# Altium project Ultrasound Smart Probe_Ver2.PrjPcb (part 3 of 9)

## Sheet Input Output Connector.SchDoc: Input Output Connectors
size 431 x 279 mm; Date: Not shown in title block; ApprovedBy: Not shown in title block; CheckedBy: Not shown in title block; Author: Not shown in title block; CompanyName: Not shown in title block; DrawnBy: Abhishek Vishwa; Engineer: Not shown in title block; Organization: Not shown in title block; Address1: Not shown in title block; Address2: Not shown in title block; Address3: Not shown in title block; Address4: Not shown in title block; DocumentNumber: 1; Revision: Use project parameter SCH_Rev; SheetNumber: 5; SheetTotal: 12; PageSetup: Record=PageOptions|CenterHorizontal=True|CenterVertical=True|PrintScale=1.00|XCorrection=1.00|YCorrection=1.00|PrintKind=0|BorderSize=5000000|LeftOffset=0|BottomOffset=0|Orientation=2|PaperLength=1000|PaperWidth=1000|Scale=100|PaperSource=15|PrintQuality=600|MediaType=1|DitherType=10|PaperKind=Letter|PrintScaleMode=1; CurrentTime: Not shown in title block; CurrentDate: Not shown in title block; Time: Not shown in title block; DocumentFullPathAndName: Not shown in title block; DocumentName: Not shown in title block; ModifiedDate: Not shown in title block; ImagePath: Not shown in title block
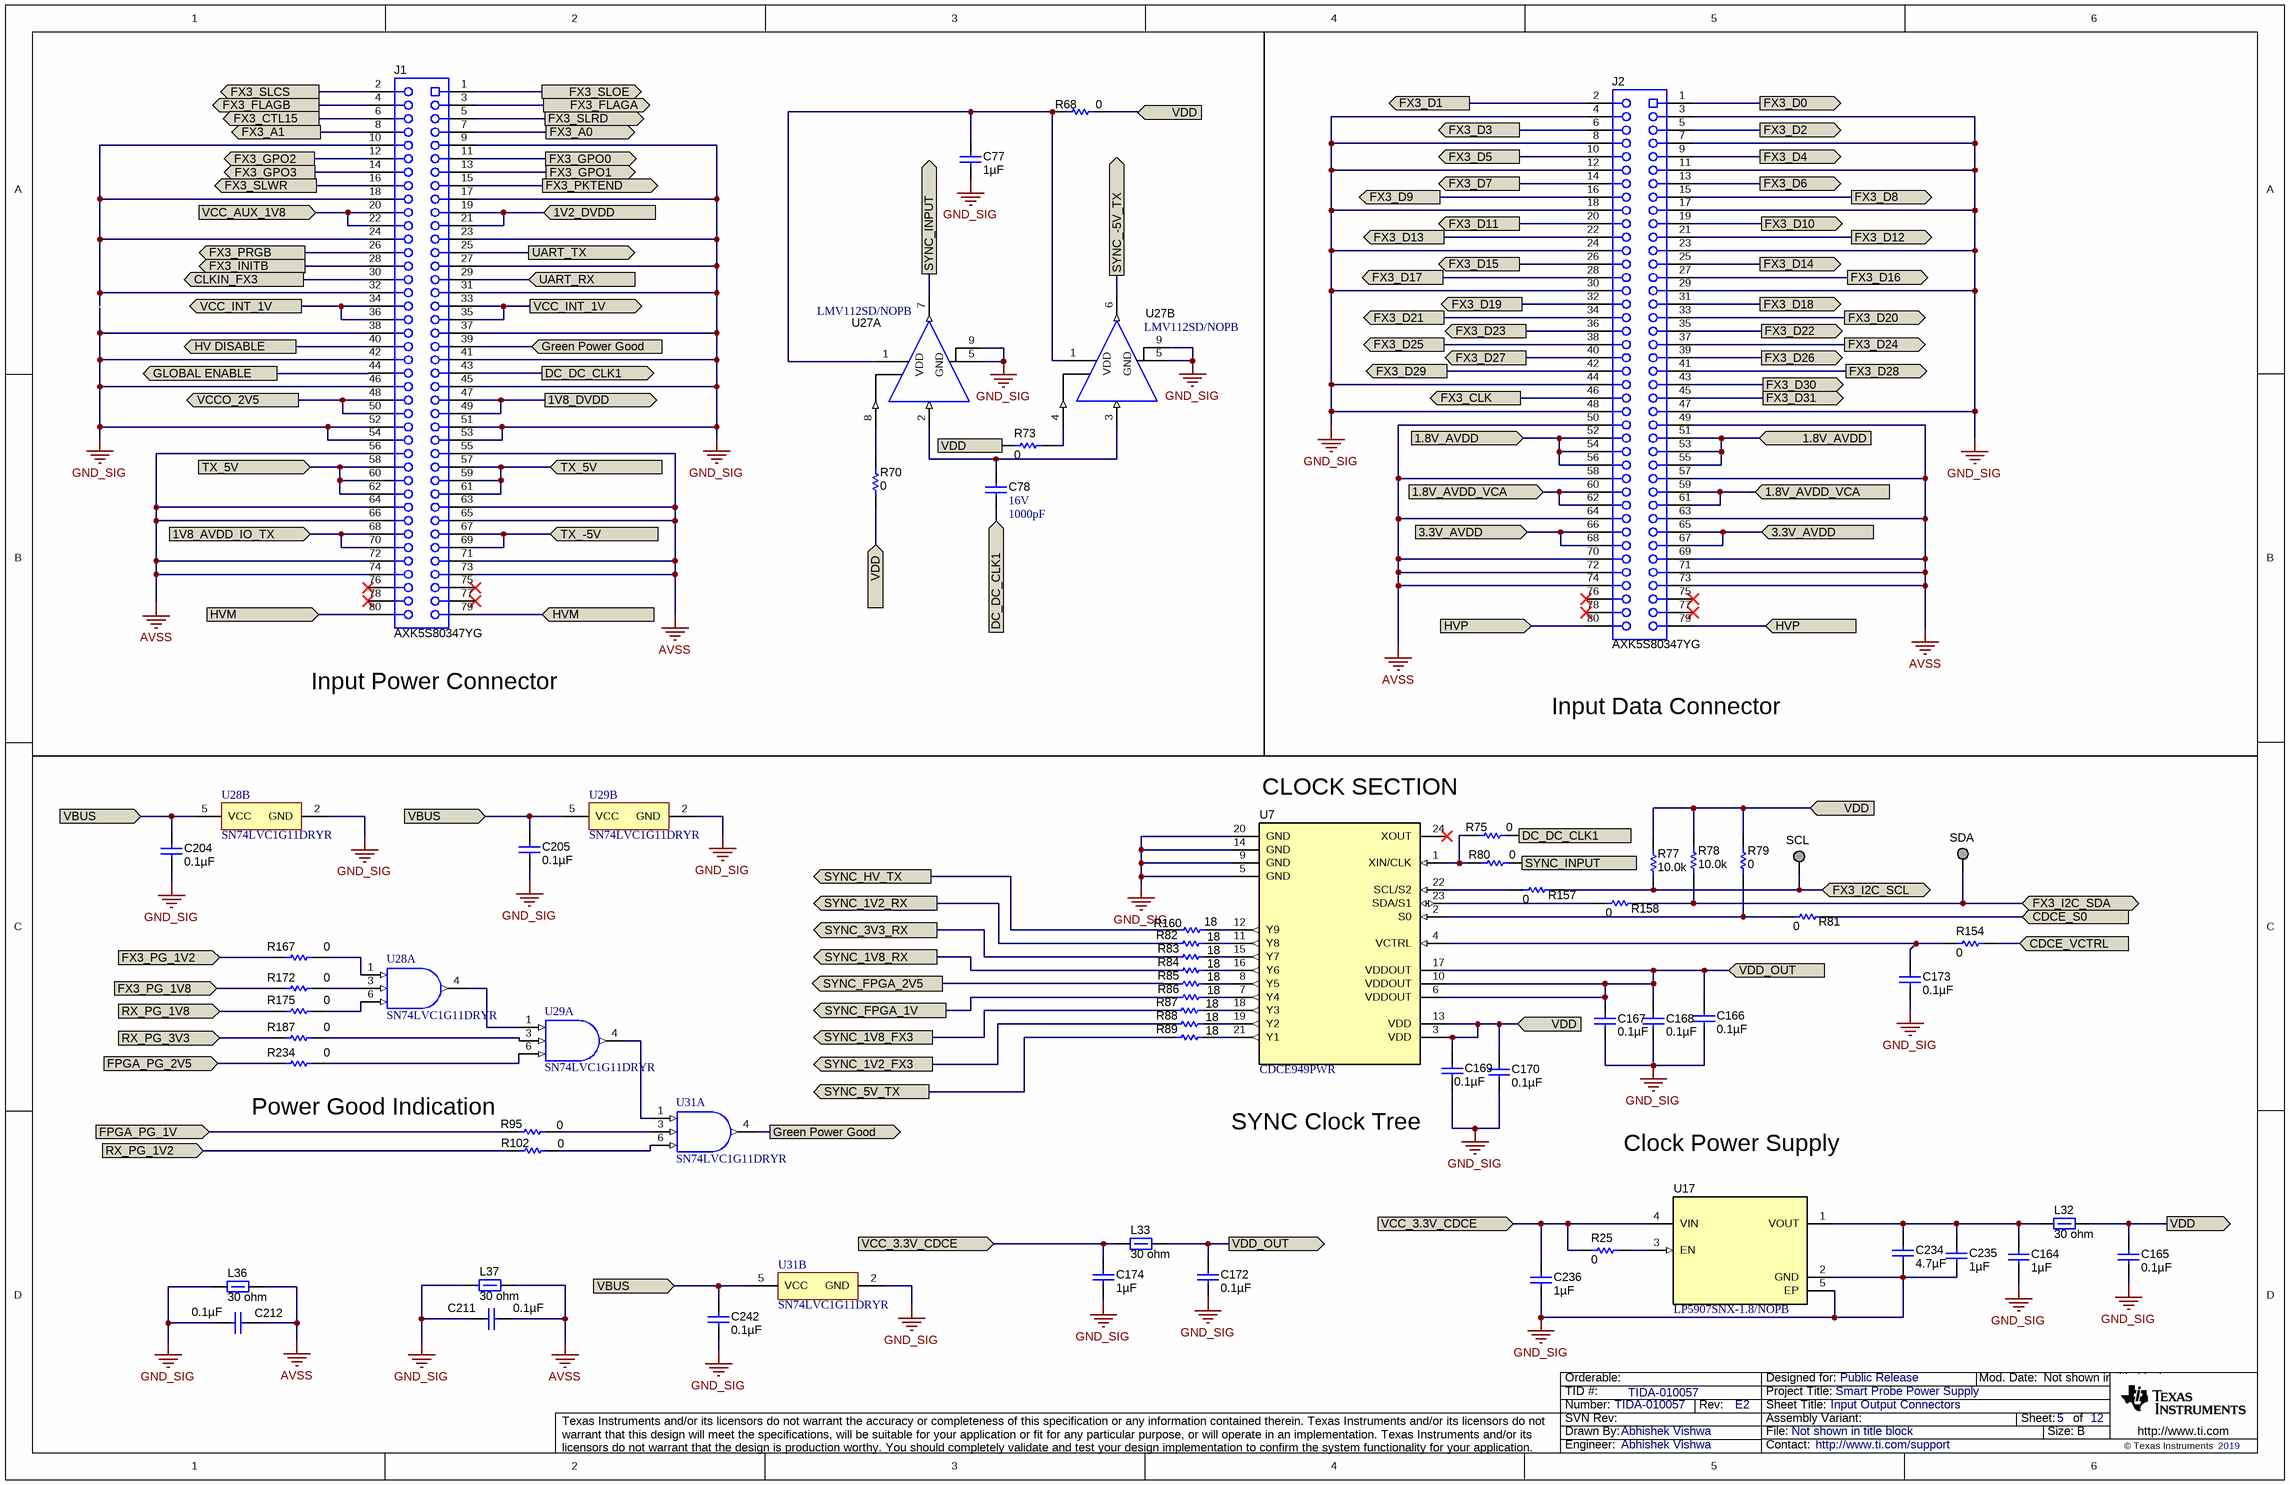
[diagram p2: Input Output Connector.SchDoc]

### Parts
C77  ValueDisplayed: 1µF  [0402]  (hidden comment: C1005X6S1C105K050BC)
C78  VDC_V: 16V  ValueDisplayed: 1000pF  [0201]  (hidden comment: GRM033R71C102KA01D)
C164  ValueDisplayed: 1µF  [0402]  (hidden comment: C1005X6S1C105K050BC)
C165  ValueDisplayed: 0.1µF  [0402]  (hidden comment: GRM155R61E104KA87D)
C166  ValueDisplayed: 0.1µF  [0402]  (hidden comment: GRM155R61E104KA87D)
C167  ValueDisplayed: 0.1µF  [0402]  (hidden comment: GRM155R61E104KA87D)
C168  ValueDisplayed: 0.1µF  [0402]  (hidden comment: GRM155R61E104KA87D)
C169  ValueDisplayed: 0.1µF  [0402]  (hidden comment: GRM155R61E104KA87D)
C170  ValueDisplayed: 0.1µF  [0402]  (hidden comment: GRM155R61E104KA87D)
C172  ValueDisplayed: 0.1µF  [0402]  (hidden comment: GRM155R61E104KA87D)
C173  ValueDisplayed: 0.1µF  [0402]  (hidden comment: GRM155R61E104KA87D)
C174  ValueDisplayed: 1µF  [0402]  (hidden comment: C1005X6S1C105K050BC)
C204  ValueDisplayed: 0.1µF  [0402]  (hidden comment: GRM155R61E104KA87D)
C205  ValueDisplayed: 0.1µF  [0402]  (hidden comment: GRM155R61E104KA87D)
C211  ValueDisplayed: 0.1µF  [0402]  (hidden comment: GRM155R61E104KA87D)
C212  ValueDisplayed: 0.1µF  [0402]  (hidden comment: GRM155R61E104KA87D)
C234  ValueDisplayed: 4.7µF  [0603]  (hidden comment: GRM188R61A475MAAJ)
C235  ValueDisplayed: 1µF  [0603]  (hidden comment: 885012206052)
C236  ValueDisplayed: 1µF  [0603]  (hidden comment: 885012206052)
C242  ValueDisplayed: 0.1µF  [0402]  (hidden comment: GRM155R61E104KA87D)
J1  AXK5S80347YG  [Panasonic_AXK5S80347Y]
J2  AXK5S80347YG  [Panasonic_AXK5S80347Y]
L32  ValueDisplayed: 30 ohm  [0603]  (hidden comment: 742792609)
L33  ValueDisplayed: 30 ohm  [0603]  (hidden comment: 742792609)
L36  ValueDisplayed: 30 ohm  [0603]  (hidden comment: 742792609)
L37  ValueDisplayed: 30 ohm  [0603]  (hidden comment: 742792609)
R25  ValueDisplayed: 0  [0402]  (hidden comment: ERJ-2GE0R00X)
R68  ValueDisplayed: 0  [0402]  (hidden comment: ERJ-2GE0R00X)
R70  ValueDisplayed: 0  [0402]  (hidden comment: ERJ-2GE0R00X)
R73  ValueDisplayed: 0  [0402]  (hidden comment: ERJ-2GE0R00X)
R75  ValueDisplayed: 0  [0402]  (hidden comment: ERJ-2GE0R00X)
R77  ValueDisplayed: 10.0k  [0402]  (hidden comment: ERJ-2RKF1002X)
R78  ValueDisplayed: 10.0k  [0402]  (hidden comment: ERJ-2RKF1002X)
R79  ValueDisplayed: 0  [0402]  (hidden comment: ERJ-2GE0R00X)
R80  ValueDisplayed: 0  [0402]  (hidden comment: ERJ-2GE0R00X)
R81  ValueDisplayed: 0  [0402]  (hidden comment: ERJ-2GE0R00X)
R82  ValueDisplayed: 18  [0402]  (hidden comment: CRCW040218R0JNED)
R83  ValueDisplayed: 18  [0402]  (hidden comment: CRCW040218R0JNED)
R84  ValueDisplayed: 18  [0402]  (hidden comment: CRCW040218R0JNED)
R85  ValueDisplayed: 18  [0402]  (hidden comment: CRCW040218R0JNED)
R86  ValueDisplayed: 18  [0402]  (hidden comment: CRCW040218R0JNED)
R87  ValueDisplayed: 18  [0402]  (hidden comment: CRCW040218R0JNED)
R88  ValueDisplayed: 18  [0402]  (hidden comment: CRCW040218R0JNED)
R89  ValueDisplayed: 18  [0402]  (hidden comment: CRCW040218R0JNED)
R95  ValueDisplayed: 0  [0201]  (hidden comment: ERJ-1GE0R00C)
R102  ValueDisplayed: 0  [0201]  (hidden comment: ERJ-1GE0R00C)
R154  ValueDisplayed: 0  [0402]  (hidden comment: ERJ-2GE0R00X)
R157  ValueDisplayed: 0  [0402]  (hidden comment: ERJ-2GE0R00X)
R158  ValueDisplayed: 0  [0402]  (hidden comment: ERJ-2GE0R00X)
R160  ValueDisplayed: 18  [0402]  (hidden comment: CRCW040218R0JNED)
R167  ValueDisplayed: 0  [0201]  (hidden comment: ERJ-1GE0R00C)
R172  ValueDisplayed: 0  [0201]  (hidden comment: ERJ-1GE0R00C)
R175  ValueDisplayed: 0  [0201]  (hidden comment: ERJ-1GE0R00C)
R187  ValueDisplayed: 0  [0201]  (hidden comment: ERJ-1GE0R00C)
R234  ValueDisplayed: 0  [0201]  (hidden comment: ERJ-1GE0R00C)
SCL  TESTPOINT  [TP_H045P075]  (value not drawn)  (no BOM)
SDA  TESTPOINT  [TP_H045P075]  (value not drawn)  (no BOM)
U7  CDCE949PWR  [PW0024A_N]
U17  LP5907SNX-1.8/NOPB  [DQN0004A]
U27  LMV112SD/NOPB  [NGQ0008A]  (parts A,B of 2)
U28  SN74LVC1G11DRYR  [DRY0006A]  (parts A,B of 2)
U29  SN74LVC1G11DRYR  [DRY0006A]  (parts A,B of 2)
U31  SN74LVC1G11DRYR  [DRY0006A]  (parts A,B of 2)

### Ports
1.8V_AVDD (in), 1.8V_AVDD_VCA (in), 1V2_DVDD (in), 1V8_AVDD_IO_TX (in), 1V8_DVDD (out), 3.3V_AVDD (in), CDCE_S0 (in), CDCE_VCTRL (in), CLKIN_FX3 (out), DC_DC_CLK1 (in), DC_DC_CLK1 (out), FPGA_PG_1V (in), FPGA_PG_2V5 (in), FX3_A0 (out), FX3_A1 (out), FX3_CLK (out), FX3_CTL15 (out), FX3_D0 (out), FX3_D1 (out), FX3_D2 (out), FX3_D3 (out), FX3_D4 (out), FX3_D5 (out), FX3_D6 (out), FX3_D7 (out), FX3_D8 (out), FX3_D9 (out), FX3_D10 (out), FX3_D11 (out), FX3_D12 (out), FX3_D13 (out), FX3_D14 (out), FX3_D15 (out), FX3_D16 (out), FX3_D17 (out), FX3_D18 (out), FX3_D19 (out), FX3_D20 (out), FX3_D21 (out), FX3_D22 (out), FX3_D23 (out), FX3_D24 (out), FX3_D25 (out), FX3_D26 (out), FX3_D27 (out), FX3_D28 (out), FX3_D29 (out), FX3_D30 (out), FX3_D31 (out), FX3_FLAGA (out), FX3_FLAGB (out), FX3_GPO0 (out), FX3_GPO1 (out), FX3_GPO2 (out), FX3_GPO3 (out), FX3_I2C_SCL (bidir), FX3_I2C_SDA (bidir), FX3_INITB (out), FX3_PG_1V2 (in), FX3_PG_1V8 (in), FX3_PKTEND (out), FX3_PRGB (out), FX3_SLCS (out), FX3_SLOE (out), FX3_SLRD (out), FX3_SLWR (out), GLOBAL ENABLE (out), Green Power Good (in), Green Power Good (out), HV DISABLE (out), HVM (in), HVP (in), RX_PG_1V2 (in), RX_PG_1V8 (in), RX_PG_3V3 (in), SYNC_1V2_FX3 (out), SYNC_1V2_RX (out), SYNC_1V8_FX3 (out), SYNC_1V8_RX (out), SYNC_3V3_RX (out), SYNC_5V_TX (out), SYNC_-5V_TX (out), SYNC_FPGA_1V (out), SYNC_FPGA_2V5 (out), SYNC_HV_TX (out), SYNC_INPUT (in), SYNC_INPUT (out), TX_5V (in), TX_-5V (in), UART_RX (in), UART_TX (out), VBUS (in), VCC_3.3V_CDCE (in), VCC_AUX_1V8 (in), VCC_INT_1V (out), VCCO_2V5 (out), VDD (in), VDD (out), VDD_OUT (in), VDD_OUT (out)

### Nets
AVSS: C211.1 C212.1 J1.55 J1.56 J1.63 J1.64 J1.65 J1.66 J1.71 J1.72 J1.73 J1.74 J2.49 J2.50 J2.57 J2.58 J2.63 J2.64 J2.69 J2.70 J2.71 J2.72 J2.73 J2.74 L36.2 L37.2
GND_SIG: C77.2 C164.2 C165.2 C166.2 C167.2 C168.2 C169.2 C170.2 C172.2 C173.2 C174.2 C204.2 C205.2 C211.2 C212.2 C234.2 C235.2 C236.2 C242.2 J1.9 J1.17 J1.23 J1.27 J1.31 J1.37 J1.38 J1.41 J1.42 J1.45 J1.46 J1.51 J1.52 J1.53 J1.54 J2.3 J2.4 J2.7 J2.8 J2.11 J2.12 J2.17 J2.18 J2.23 J2.24 J2.29 J2.30 J2.44 J2.47 J2.48 L36.1 L37.1 U7.5(GND) U7.9(GND) U7.14(GND) U7.20(GND) U17.2(GND) U17.5(EP) U27.5(GND) U27.9(PAD) U28.2(GND) U29.2(GND) U31.2(GND)
1.8V_AVDD: J2.51 J2.52 J2.53 J2.54 J2.55 J2.56 ; port 1.8V_AVDD
1.8V_AVDD_VCA: J2.59 J2.60 J2.61 J2.62 ; port 1.8V_AVDD_VCA
1V2_DVDD: J1.19 J1.21 ; port 1V2_DVDD
1V8_AVDD_IO_TX: J1.68 J1.70 ; port 1V8_AVDD_IO_TX
1V8_DVDD: J1.47 J1.49 ; port 1V8_DVDD
3.3V_AVDD: J2.65 J2.66 J2.67 J2.68 ; port 3.3V_AVDD
CDCE_S0: R81.1 ; port CDCE_S0
CDCE_VCTRL: R154.1 ; port CDCE_VCTRL
CLKIN_FX3: J1.30 ; port CLKIN_FX3
DC_DC_CLK1: C78.2 J1.43 R75.2 ; port DC_DC_CLK1
FPGA_PG_1V: R95.1 ; port FPGA_PG_1V
FPGA_PG_2V5: R234.1 ; port FPGA_PG_2V5
FX3_A0: J1.7 ; port FX3_A0
FX3_A1: J1.8 ; port FX3_A1
FX3_CLK: J2.46 ; port FX3_CLK
FX3_CTL15: J1.6 ; port FX3_CTL15
FX3_D0: J2.1 ; port FX3_D0
FX3_D1: J2.2 ; port FX3_D1
FX3_D2: J2.5 ; port FX3_D2
FX3_D3: J2.6 ; port FX3_D3
FX3_D4: J2.9 ; port FX3_D4
FX3_D5: J2.10 ; port FX3_D5
FX3_D6: J2.13 ; port FX3_D6
FX3_D7: J2.14 ; port FX3_D7
FX3_D8: J2.15 ; port FX3_D8
FX3_D9: J2.16 ; port FX3_D9
FX3_D10: J2.19 ; port FX3_D10
FX3_D11: J2.20 ; port FX3_D11
FX3_D12: J2.21 ; port FX3_D12
FX3_D13: J2.22 ; port FX3_D13
FX3_D14: J2.25 ; port FX3_D14
FX3_D15: J2.26 ; port FX3_D15
FX3_D16: J2.27 ; port FX3_D16
FX3_D17: J2.28 ; port FX3_D17
FX3_D18: J2.31 ; port FX3_D18
FX3_D19: J2.32 ; port FX3_D19
FX3_D20: J2.33 ; port FX3_D20
FX3_D21: J2.34 ; port FX3_D21
FX3_D22: J2.35 ; port FX3_D22
FX3_D23: J2.36 ; port FX3_D23
FX3_D24: J2.37 ; port FX3_D24
FX3_D25: J2.38 ; port FX3_D25
FX3_D26: J2.39 ; port FX3_D26
FX3_D27: J2.40 ; port FX3_D27
FX3_D28: J2.41 ; port FX3_D28
FX3_D29: J2.42 ; port FX3_D29
FX3_D30: J2.43 ; port FX3_D30
FX3_D31: J2.45 ; port FX3_D31
FX3_FLAGA: J1.3 ; port FX3_FLAGA
FX3_FLAGB: J1.4 ; port FX3_FLAGB
FX3_GPO0: J1.11 ; port FX3_GPO0
FX3_GPO1: J1.13 ; port FX3_GPO1
FX3_GPO2: J1.12 ; port FX3_GPO2
FX3_GPO3: J1.14 ; port FX3_GPO3
FX3_I2C_SCL: R77.1 R157.1 SCL.1 ; port FX3_I2C_SCL
FX3_I2C_SDA: R78.1 R158.1 SDA.1 ; port FX3_I2C_SDA
FX3_INITB: J1.28 ; port FX3_INITB
FX3_PG_1V2: R167.1 ; port FX3_PG_1V2
FX3_PG_1V8: R172.1 ; port FX3_PG_1V8
FX3_PKTEND: J1.15 ; port FX3_PKTEND
FX3_PRGB: J1.26 ; port FX3_PRGB
FX3_SLCS: J1.2 ; port FX3_SLCS
FX3_SLOE: J1.1 ; port FX3_SLOE
FX3_SLRD: J1.5 ; port FX3_SLRD
FX3_SLWR: J1.16 ; port FX3_SLWR
GLOBAL ENABLE: J1.44 ; port GLOBAL ENABLE
Green Power Good: J1.39 U31.4(Y) ; port Green Power Good
HV DISABLE: J1.40 ; port HV DISABLE
HVM: J1.79 J1.80 ; port HVM
HVP: J2.79 J2.80 ; port HVP
RX_PG_1V2: R102.1 ; port RX_PG_1V2
RX_PG_1V8: R175.1 ; port RX_PG_1V8
RX_PG_3V3: R187.1 ; port RX_PG_3V3
SYNC_1V2_FX3: R88.1 ; port SYNC_1V2_FX3
SYNC_1V2_RX: R82.1 ; port SYNC_1V2_RX
SYNC_1V8_FX3: R87.1 ; port SYNC_1V8_FX3
SYNC_1V8_RX: R84.1 ; port SYNC_1V8_RX
SYNC_3V3_RX: R83.1 ; port SYNC_3V3_RX
SYNC_5V_TX: R89.1 ; port SYNC_5V_TX
SYNC_-5V_TX: U27.6(OUT2) ; port SYNC_-5V_TX
SYNC_FPGA_1V: R86.1 ; port SYNC_FPGA_1V
SYNC_FPGA_2V5: R85.1 ; port SYNC_FPGA_2V5
SYNC_HV_TX: R160.1 ; port SYNC_HV_TX
SYNC_INPUT: R80.2 U27.7(OUT1) ; port SYNC_INPUT
TX_5V: J1.57 J1.58 J1.59 J1.60 J1.61 J1.62 ; port TX_5V
TX_-5V: J1.67 J1.69 ; port TX_-5V
UART_RX: J1.29 ; port UART_RX
UART_TX: J1.25 ; port UART_TX
VBUS: C204.1 C205.1 C242.1 U28.5(VCC) U29.5(VCC) U31.5(VCC) ; port VBUS
VCC_3.3V_CDCE: C174.1 C236.1 L33.1 R25.2 U17.4(VIN) ; port VCC_3.3V_CDCE
VCC_AUX_1V8: J1.20 J1.22 ; port VCC_AUX_1V8
VCC_INT_1V: J1.33 J1.34 J1.35 J1.36 ; port VCC_INT_1V
VCCO_2V5: J1.48 J1.50 ; port VCCO_2V5
VDD: C165.1 C169.1 C170.1 L32.2 R68.1 R70.2 R73.1 R77.2 R78.2 R79.2 U7.3(VDD) U7.13(VDD) ; port VDD
VDD_OUT: C166.1 C167.1 C168.1 C172.1 L33.2 U7.6(VDDOUT) U7.10(VDDOUT) U7.17(VDDOUT) ; port VDD_OUT
NetC77_1: C77.1 R68.2 U27.1(VDD)
NetC78_1: C78.1 U27.2(IN1) U27.3(IN2)
NetC164_1: C164.1 C234.1 C235.1 L32.1 U17.1(VOUT)
NetC173_1: C173.1 R154.2 U7.4(VCTRL)
NetJ1_10: J1.10 J1.18 J1.24 J1.32
NetR25_1: R25.1 U17.3(EN)
NetR70_1: R70.1 U27.8(EN1)
NetR73_2: R73.2 U27.4(EN2)
NetR75_1: R75.1 R80.1 U7.1(XIN/CLK)
NetR79_1: R79.1 R81.2 U7.2(S0)
NetR82_2: R82.2 U7.11(Y8)
NetR83_2: R83.2 U7.15(Y7)
NetR84_2: R84.2 U7.16(Y6)
NetR85_2: R85.2 U7.8(Y5)
NetR86_2: R86.2 U7.7(Y4)
NetR87_2: R87.2 U7.18(Y3)
NetR88_2: R88.2 U7.19(Y2)
NetR89_2: R89.2 U7.21(Y1)
NetR95_2: R95.2 U31.3(B)
NetR102_2: R102.2 U31.6(C)
NetR157_2: R157.2 U7.22(SCL/S2)
NetR158_2: R158.2 U7.23(SDA/S1)
NetR160_2: R160.2 U7.12(Y9)
NetR167_2: R167.2 U28.1(A)
NetR172_2: R172.2 U28.3(B)
NetR175_2: R175.2 U28.6(C)
NetR187_2: R187.2 U29.3(B)
NetR234_2: R234.2 U29.6(C)
NetU28_4: U28.4(Y) U29.1(A)
NetU29_4: U29.4(Y) U31.1(A)

Not connected (* = marked no-connect by the designer): J1 75* 76* 77* 78*; J2 75* 76* 77* 78*; U7 24(XOUT)*

### Notes on the sheet
- Input Power Connector
- Input Data Connector
- CLOCK SECTION
- Power Good Indication
- SYNC Clock Tree
- Clock Power Supply
- Drawn By:
- SVN Rev:
- Number:
- TID #:
- Orderable:
- Rev:
- Sheet Title:
- File:
- Project Title:
- Designed for:
- Assembly Variant:
- Mod. Date:
- Sheet:
- Size:
- of
- B
- http://www.ti.com
- Texas Instruments and/or its licensors do not warrant the accuracy or completeness of this specification or any information contained therein. Texas Instruments and/or its licensors do not warrant that this design will meet the specifications, will be suitable for your application or fit for any particular purpose, or will operate in an implementation. Texas Instruments and/or its licensors do not warrant that the design is production worthy. You should completely validate and test your design implementation to confirm the system functionality for your application.
- Engineer:
- Contact:
- © Texas Instruments

### Library data of the parts
C77 C164 C174 = C1005X6S1C105K050BC: CAP, CERM, 1 µF, 16 V,+/- 10%, X6S, 0402; Manufacturer: TDK; Polarized: N; CompType: Capacitor; Value: 1uF; U/M: EA; Cap_F: 0.000001; Tolerance_%: 10; ESR_ohm: 0.011416; Value1: 0.011416 ohm; VDC_V: 16; Value2: 16V; IRMS_A: 1.483; TaMin_C: -55; TaMax_C: 105; SizeArea_mm2: 0.5; SizeAreaWB_mm2: 3; SizeX_mm: 1; SizeZ_mm: 0.6; AEC Category: Q200; SymbolVersion: 2008-07-09; PartNumber: C1005X6S1C105K050BC; PackageReference: 0402; RoHS: Y; MountType: SMT; Technology: Ceramic; TempCo: X6S; Cap_Case: 0402; SizeY_mm: 0.5; Published: 2008-06-19; Publisher: Texas Instruments; LatestRevisionDate: 2017-06-22; ComponentLink1Description: Datasheet link; ComponentLink1URL: https://product.tdk.com/en/search/capacitor/ceramic/mlcc/info?part_no=C1005X6S1C105K050BC; Supplier 1: Digi-Key; Supplier Part Number 1: 445-9086-1-ND; Supplier 2: Mouser; Supplier Part Number 2: 810-C1005X6S1C105K050BC; AEC Qualified: N; AEC Grade: N/A
C78 = CMP-0009745-1: CAP CER 1000PF 25V X7R 0201; Manufacturer: Samsung Electro-Mechanics; PartNumber: CL03B102KA3NNNC; TaMin_C: -55°C; Polarized: N; SizeAreaWB_mm2: 2.08; Value1: Unknown; U/M: EA; TaMax_C: 125°C; Tolerance_%: 10%; SizeZ_mm: 0.26; SizeX_mm: 0.6; SizeY_mm: 0.3; SizeArea_mm2: 0.18; Cap_F: 1nF; AEC Category: Q200; ComponentLink1URL: http://search.murata.co.jp/Ceramy/PnsearchViewAction.do?HnOFG=ON&HnNFG=ON&SEL_CNT=50&sLang=en&sKey=GRM033R71C102KA01D&x=9&y=9&search=startwith; Publisher: Texas Instruments; Supplier 2: Mouser; TempCo: X7R; Published: 2008-06-19; RoHS: Y; MountType: SMT; Value: 1000pF; Supplier 1: Digi-Key; PackageReference: 0201; Cap_Case: 0201; Value2: 16V; CompType: Capacitor; LatestRevisionDate: 2017-03-09; AEC Qualified: ?; ComponentLink1Description: Datasheet link; Supplier Part Number 1: 1276-1341-2-ND; Technology: Ceramic
C165-C170 C172 C173 C204 C205 C211 C212 C242 = GRM155R61E104KA87D: CAP, CERM, 0.1 µF, 25 V,+/- 10%, X5R, 0402; Manufacturer: MuRata; Polarized: N; CompType: Capacitor; Value: 0.1uF; U/M: EA; Cap_F: 0.0000001; Tolerance_%: 10; VDC_V: 25; Value2: 25V; TaMin_C: -55; TaMax_C: 85; SizeArea_mm2: 0.5; SizeAreaWB_mm2: 3; SizeX_mm: 1; SizeZ_mm: 0.6; AEC Category: Q200; Green_Lifecycle: Active; Green_REACh: Passed; SymbolVersion: 2008-07-09; PartNumber: GRM155R61E104KA87D; PackageReference: 0402; RoHS: Y; MountType: SMT; Technology: Ceramic; TempCo: X5R; Cap_Case: 0402; SizeY_mm: 0.5; Published: 2008-06-19; Publisher: Texas Instruments; LatestRevisionDate: 2017-06-22; ComponentLink1Description: Datasheet link; ComponentLink1URL: http://psearch.murata.com/capacitor/product/GRM155R61E104KA87%23.pdf; Supplier 1: Digi-Key; Supplier Part Number 1: 490-5920-1-ND; Supplier 2: Mouser; Supplier Part Number 2: 81-GRM155R61E104KA7D; AEC Qualified: N; AEC Grade: N/A; Green_EU RoHS: Passed; Green_EU RoHS-2: Passed
C234 = GRM188R61A475MAAJ: CAP, CERM, 4.7 µF, 10 V,+/- 20%, X5R, 0603; Manufacturer: MuRata; Polarized: N; CompType: Capacitor; Value: 4.7uF; U/M: EA; Cap_F: 0.0000047; Tolerance_%: 20; VDC_V: 10; Value2: 10V; TaMin_C: -55; TaMax_C: 85; SizeArea_mm2: 1.28; SizeAreaWB_mm2: 4.68; SizeX_mm: 1.6; SizeY_mm: 0.8; SizeZ_mm: 1; AEC Category: Q200; SymbolVersion: 2008-07-09; PartNumber: GRM188R61A475MAAJ; PackageReference: 0603; RoHS: Y; MountType: SMT; Technology: Ceramic; TempCo: X5R; Cap_Case: 0603; Published: 2008-06-19; Publisher: Texas Instruments; LatestRevisionDate: 2017-06-22; ComponentLink1Description: Datasheet link; ComponentLink1URL: http://psearch.en.murata.com/capacitor/product/GRM188R61A475MAAJ%23.pdf; AEC Qualified: N; AEC Grade: N/A
C235 C236 = 885012206052: CAP, CERM, 1 µF, 16 V,+/- 10%, X7R, 0603; Manufacturer: Wurth Elektronik; Polarized: N; CompType: Capacitor; Value: 1uF; U/M: EA; Cap_F: 0.000001; Tolerance_%: 10; VDC_V: 16; Value2: 16V; TaMin_C: -55; TaMax_C: 125; SizeArea_mm2: 1.28; SizeAreaWB_mm2: 4.68; SizeX_mm: 1.6; SizeY_mm: 0.8; SizeZ_mm: 1; AEC Category: Q200; Green_Lifecycle: Active; Green_REACh: Passed; SymbolVersion: 2008-07-09; PartNumber: 885012206052; PackageReference: 0603; RoHS: Y; MountType: SMT; Technology: Ceramic; TempCo: X7R; Cap_Case: 0603; Published: 2008-06-19; Publisher: Texas Instruments; LatestRevisionDate: 2017-06-22; ComponentLink1Description: Datasheet link; ComponentLink1URL: http://katalog.we-online.de/pbs/datasheet/885012206052.pdf; Supplier 1: Mouser; Supplier Part Number 1: 710-885012206052; AEC Qualified: N; AEC Grade: N/A; Green_EU RoHS: Passed; Green_EU RoHS-2: Incomplete
J1 J2 = CMP-0084862-1: Receptacle, 0.5mm, 40x2, Gold, SMD; Manufacturer: Panasonic; RowSpacing_mm: 4.4; Row_Count: 2; Pitch_mm: 0.5; Gender: Female; CompType: Socket Strip; RoHS: Y; MountType: SMT; Color: White; ComponentLink1URL: https://www3.panasonic.biz/ac/e_download/control/connector/base-base/catalog/con_eng_p5k.pdf; ComponentLink1Description: Datasheet URL; PinCount: 80; PackageReference: Receptacle, 0.5mm, 40x2, SMD; ContactFinish: Gold; Orientation: Vertical; PartNumber: AXK5S80347YG
L32 L33 L36 L37 = 742792609: Ferrite Bead, 30 ohm @ 100 MHz, 3 A, 0603; Manufacturer: Wurth Elektronik; Value: 30 ohm; Imax_A: 3; DCR_ohm: 0.04; Value1: 0.04 ohm; Value2: 3A; SizeAreaWB_mm2: 4.68; SizeArea_mm2: 1.28; SizeX_mm: 1.6; SizeY_mm: 0.8; SizeZ_mm: 1; ZTyp@100MHz_Ohm: 30; Ztyp@1GHz_Ohm: 40.472; Green_Lifecycle: Active; Green_REACh: Passed; SymbolVersion: 2017-01-06; PartNumber: 742792609; CompType: Ferrite Bead; MountType: SMT; PackageReference: 0603; Published: 2014-04-30; Publisher: Texas Instruments; LatestRevisionDate: 2017-06-22; ComponentLink1Description: Datasheet link; ComponentLink1URL: http://katalog.we-online.de/pbs/datasheet/742792609.pdf; RoHS: Y; Supplier 1: Digi-Key; Supplier Part Number 1: 732-1591-1-ND; Supplier 2: Mouser; Supplier Part Number 2: 710-742792609; Green_EU RoHS: Passed; Green_EU RoHS-2: Incomplete
R25 R68 R70 R73 R75 R79-R81 R154 R157 R158 = ERJ-2GE0R00X: RES, 0, 5%, 0.063 W, 0402; Manufacturer: Panasonic; CompType: Resistor; Value: 0; Value_Code: 0000; Tolerance_%: 5; Power_W: 0.063; Value2: 0.063W; VDC_V: 50; TempCo: 600 ppm/C; SizeArea_mm2: 0.5; SizeX_mm: 1; SizeZ_mm: 0.6; EIA_Code: E24; U/M: EA; AEC Category: Q200; Green_Lifecycle: Active; Green_REACh: Passed; SymbolVersion: 2009-05-29; PartNumber: ERJ-2GE0R00X; PackageReference: 0402; RoHS: Y; Res_ohm: 0; Value1: 5%; MountType: SMT; Technology: Thick Film; SizeY_mm: 0.5; Published: 2008-06-26; Publisher: Texas Instruments; LatestRevisionDate: 2017-06-12; ComponentLink1Description: Datasheet link; ComponentLink1URL: http://www.panasonic.com/industrial/components/pdf/AOA0000CE1.pdf; Supplier 1: Digi-Key; Supplier Part Number 1: P0.0JCT-ND; Supplier 2: Newark; Supplier Part Number 2: 65T8307; Supplier 3: Mouser; Supplier Part Number 3: 667-ERJ-2GE0R00X; AEC Qualified: ?; Green_EU RoHS: Passed with Exemption; Green_EU RoHS-2: Passed
R77 R78 = ERJ-2RKF1002X: RES, 10.0 k, 1%, 0.1 W, 0402; Manufacturer: Panasonic; CompType: Resistor; Value: 10.0k; Res_ohm: 10000; Value_Code: 10k0; Tolerance_%: 1; Power_W: 0.1; Value2: 0.1W; VDC_V: 50; TempCo: 100 ppm/C; SizeArea_mm2: 0.5; SizeZ_mm: 0.6; EIA_Code: E96; U/M: EA; AEC Category: Q200; Green_Lifecycle: Active; Green_REACh: Passed; SymbolVersion: 2009-05-29; PartNumber: ERJ-2RKF1002X; PackageReference: 0402; RoHS: Y; Value1: 1%; MountType: SMT; Technology: Thick Film; SizeX_mm: 1; SizeY_mm: 0.5; Published: 2008-06-26; Publisher: Texas Instruments; LatestRevisionDate: 2017-06-12; ComponentLink1Description: Datasheet link; ComponentLink1URL: http://industrial.panasonic.com/www-data/pdf/AOA0000/AOA0000CE2.pdf; Supplier 1: Digi-Key; Supplier Part Number 1: P10.0KLCT-ND; Supplier 2: Newark; Supplier Part Number 2: 90W2949; Supplier 3: Mouser; Supplier Part Number 3: 667-ERJ-2RKF1002X; AEC Qualified: ?; Green_EU RoHS: Passed with Exemption; Green_EU RoHS-2: Passed
R82-R89 R160 = CRCW040218R0JNED: RES, 18, 5%, 0.063 W, 0402; Manufacturer: Vishay-Dale; CompType: Resistor; Value: 18; Value_Code: 18R0; Tolerance_%: 5; Power_W: 0.063; Value2: 0.063W; VDC_V: 50; TempCo: 200 ppm/C; SizeArea_mm2: 0.5; SizeX_mm: 1; SizeZ_mm: 0.6; EIA_Code: E24; U/M: EA; AEC Category: Q200; Green_Lifecycle: Active; Green_REACh: Passed; SymbolVersion: 2009-05-29; PartNumber: CRCW040218R0JNED; PackageReference: 0402; RoHS: Y; Res_ohm: 18; Value1: 5%; MountType: SMT; Technology: Thick Film; SizeY_mm: 0.5; Published: 2008-06-26; Publisher: Texas Instruments; LatestRevisionDate: 2017-06-12; ComponentLink1Description: Datasheet link; ComponentLink1URL: http://www.vishay.com/docs/20035/dcrcwe3.pdf; Supplier 1: Digi-Key; Supplier Part Number 1: 541-18JCT-ND; Supplier 2: Newark; Supplier Part Number 2: 59M6708; Supplier 3: Mouser; Supplier Part Number 3: 71-CRCW0402J-18-E3; AEC Qualified: ?; Green_EU RoHS: Passed with Exemption; Green_EU RoHS-2: Passed
R95 R102 R167 R172 R175 R187 R234 = ERJ-1GE0R00C: RES, 0, 5%, 0.05 W, 0201; Manufacturer: Panasonic; CompType: Resistor; Value: 0; Value_Code: 0000; Tolerance_%: 5; Power_W: 0.05; Value2: 0.05W; VDC_V: 15; TempCo: 600 ppm/C; SizeArea_mm2: 0.18; SizeX_mm: 0.6; SizeY_mm: 0.3; SizeZ_mm: 0.26; EIA_Code: E24; U/M: EA; AEC Category: Q200; SymbolVersion: 2009-05-29; PartNumber: ERJ-1GE0R00C; PackageReference: 0201; RoHS: Y; Res_ohm: 0; Value1: 5%; MountType: SMT; Technology: Thick Film; Published: 2016-10-14; Publisher: Texas Instruments; LatestRevisionDate: 2017-04-07; ComponentLink1Description: Datasheet link; ComponentLink1URL: http://www.panasonic.com/industrial/components/pdf/AOA0000CE1.pdf; Supplier 1: Digi-Key; Supplier Part Number 1: P0.0AGCT-ND; Supplier 2: Newark; Supplier Part Number 2: 53W4043; Supplier 3: Mouser; Supplier Part Number 3: 667-ERJ-1GE0R00C; AEC Qualified: ?
SCL SDA = TP_H0.45P0.75: Manufacturer: Texas Instruments; CompType: Pad; SymbolVersion: 2010-10-20; PartNumber: TP_H0.45P0.75; PackageReference: Test Point, 0.45mm hole size; MountType: TH; ComponentLink1Description: Datasheet Link; ComponentLink1URL: https://sps06.itg.ti.com/sites/KMS/crossdivteams/altium/docs/ComponentDatasheets/testpin with 750um Padsice and 450um drillhole.pdf; Publisher: Texas Instruments; LatestRevisionDate: 2016-03-31
U7 = CMP-0075866-2: Programmable 4-PLL VCXO Clock Synthesizer with 2.5V or 3.3V LVCMOS Outputs, PW0024A (TSSOP-24); Manufacturer: Texas Instruments; SizeAreaWB_mm2: 82.32; SizeArea_mm2: 49.92; SizeZ_mm: 1.2; SizeY_mm: 7.8; CompType: IC; SizeX_mm: 6.4; AEC Category: Q200; AEC Qualified: N; Rating: Catalog; ComponentLink1Description: Datasheet Link; RoHS: Y; PackageReference: PW0024A; PartNumber: CDCE949PWR; PackageDescription: TSSOP-24; Alternate Manufacturer: Texas Instruments; ComponentLink1URL: http://www.ti.com/lit/ds/symlink/cdce949.pdf; Alternate PartNumber: CDCE949PW; MountType: SMT; ComponentLink2Description: Product Folder; ComponentLink2URL: http://www.ti.com/product/cdce949; ComponentLink3Description: Online Datasheet; ComponentLink3URL: http://www.ti.com/product/cdce949/datasheet; Operating Temperature Range: -40 to 85 C
U17 = CMP-0076242-1: 250-mA Ultra-Low-Noise, Low-IQ LDO, DQN0004A (X2SON-4); Manufacturer: Texas Instruments; SizeAreaWB_mm2: 4.0; SizeArea_mm2: 1.0; SizeZ_mm: 0.4; U/M: EA; CompType: IC; ComponentLink1Description: Datasheet Link; RoHS: Y; PackageReference: DQN0004A; PartNumber: LP5907SNX-1.8/NOPB; Publisher: Texas Instruments; PackageDescription: X2SON-4; SizeY_mm: 1.0; Alternate Manufacturer: Texas Instruments; ComponentLink1URL: http://www.ti.com/lit/ds/symlink/lp5907.pdf; LatestRevisionDate: 2017-06-09; MountType: SMT; SizeX_mm: 1.0
U27 = CMP-0065664-2: 40 MHz Dual Clock Buffer, NGQ0008A (WSON-8); Alternate Manufacturer: Texas Instruments; SizeAreaWB_mm2: 16.0; SizeZ_mm: 0.8; SizeX_mm: 3.0; SizeArea_mm2: 9.0; CompType: IC; AEC Category: Q200; AEC Qualified: N; ComponentLink1URL: http://www.ti.com/lit/ds/symlink/lmv112.pdf; PackageDescription: WSON-8; RoHS: Y; MountType: SMT; Manufacturer: Texas Instruments; PackageReference: NGQ0008A; SizeY_mm: 3.0; PartNumber: LMV112SD/NOPB; ComponentLink1Description: Datasheet Link; ComponentLink2Description: Product Folder; ComponentLink2URL: http://www.ti.com/product/lmv112; ComponentLink3Description: Online Datasheet; ComponentLink3URL: http://www.ti.com/product/lmv112/datasheet; PartId: 1
U28 U29 U31 = CMP-0051217-4: Single 3-Input Positive-AND Gate, DRY0006A (USON-6); Manufacturer: Texas Instruments; Output Type: CMOS; Bits(#): 1; Input Type: CMOS/TTL; Technology Family: LVC; Schmitt Trigger: No; VCC(Max)(V): 5.5; Gate Type: AND; Rating: Catalog; Output Drive (IOL/IOH)(Max)(mA): 32/-32; ICC @ Nom Voltage(Max)(mA): 0.01; VCC(Min)(V): 1.65; F @ Nom Voltage(Max)(Mhz): 150; Logic: True; Voltage(Nom)(V): 1.8,2.5,3.3,5; tpd @ Nom Voltage(Max)(ns): 20,7.8,6.2,4.6; AEC Category: Q200; AEC Qualified: N; CompType: IC; SizeAreaWB_mm2: 4.9; SizeArea_mm2: 1.45; SizeX_mm: 1.0; SizeZ_mm: 0.6; 3-State Output: No; Operating Temperature Range(C): -40 to 125,-40 to 85; PackageReference: DRY0006A; Generic Part Number: SN74LVC1G11; ComponentLink1Description: Datasheet Link; ComponentLink1URL: http://www.ti.com/lit/ds/symlink/sn74lvc1g11.pdf; ComponentLink2Description: Product Folder; ComponentLink2URL: http://www.ti.com/product/sn74lvc1g11; ComponentLink3Description: Online Datasheet; ComponentLink3URL: http://www.ti.com/product/sn74lvc1g11/datasheet; MountType: SMT; PackageDescription: USON-6; PartNumber: SN74LVC1G11DRYR; SizeY_mm: 1.45; Operating Temperature Range: -40 to 125 C; PartId: 1